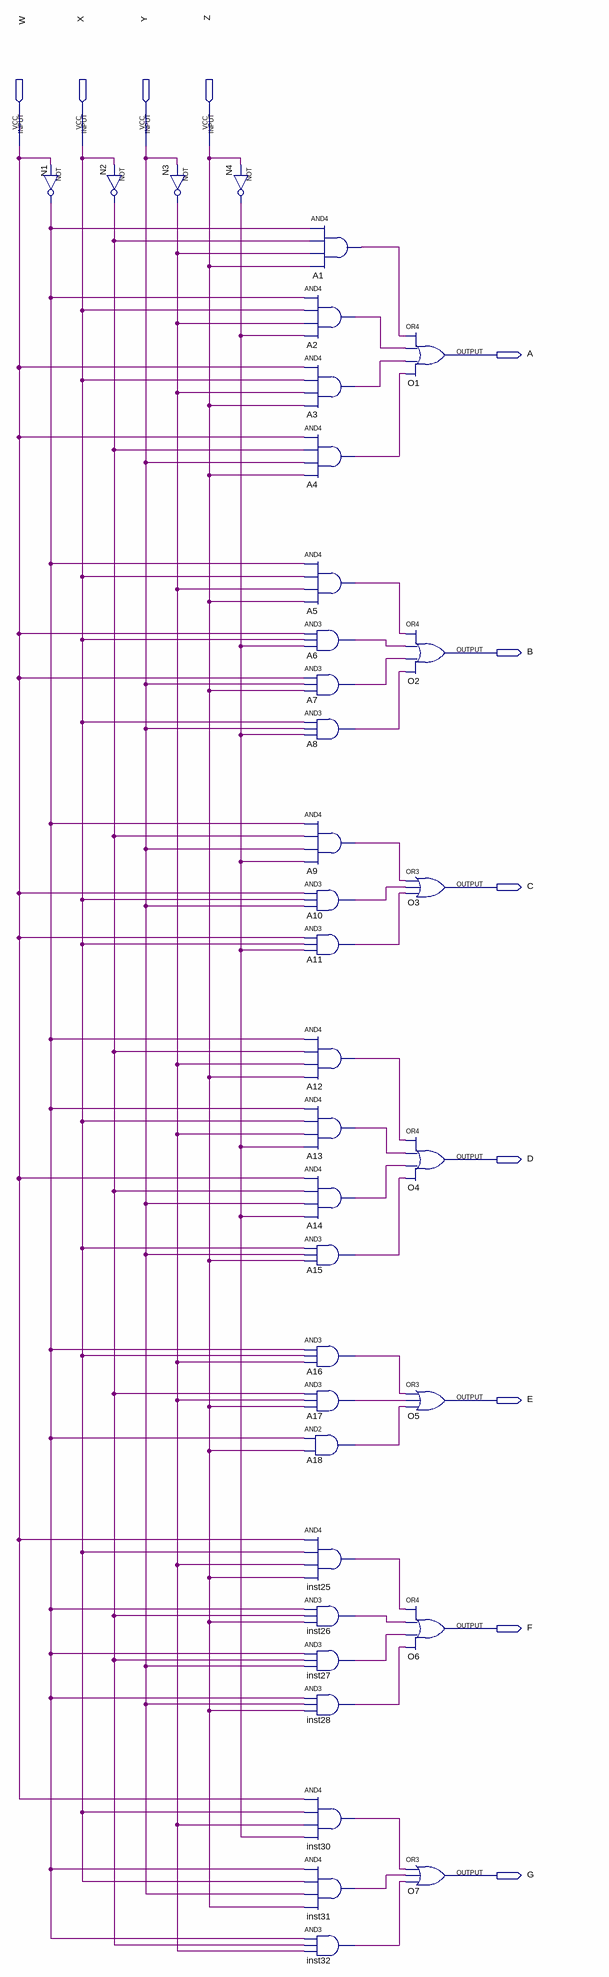
[diagram p0: schematic sheet]
// Quartus schematic lab4.bdf as structural Verilog: 36 symbols, 11 pins
module lab4 (
  input  W,
  input  X,
  input  Y,
  input  Z,
  output A,
  output B,
  output C,
  output D,
  output E,
  output F,
  output G
);

  wire A1_out, A2_out, A3_out, A4_out, A5_out, A6_out, A7_out, A8_out, A9_out, A10_out, A11_out, A12_out,
       A13_out, A14_out, A15_out, A16_out, A17_out, A18_out, inst25_out, inst26_out, inst27_out, inst28_out,
       inst30_out, inst31_out, inst32_out, N1_out, N2_out, N3_out, N4_out;

  not N1 (N1_out, W);
  not N2 (N2_out, X);
  not N3 (N3_out, Y);
  not N4 (N4_out, Z);
  and A1 (A1_out, N1_out, N2_out, N3_out, Z);
  and A2 (A2_out, N1_out, X, N3_out, N4_out);
  and A3 (A3_out, W, X, N3_out, Z);
  and A4 (A4_out, W, N2_out, Y, Z);
  and A5 (A5_out, N1_out, X, N3_out, Z);
  and A6 (A6_out, W, X, N4_out);
  and A7 (A7_out, W, Y, Z);
  and A8 (A8_out, X, Y, N4_out);
  and A9 (A9_out, N1_out, N2_out, Y, N4_out);
  and A10 (A10_out, W, X, Y);
  and A11 (A11_out, W, X, N4_out);
  and A12 (A12_out, N1_out, N2_out, N3_out, Z);
  and A13 (A13_out, N1_out, X, N3_out, N4_out);
  and A14 (A14_out, W, N2_out, Y, N4_out);
  and A15 (A15_out, X, Y, Z);
  and A16 (A16_out, N1_out, X, N3_out);
  and A17 (A17_out, N2_out, N3_out, Z);
  and A18 (A18_out, N1_out, Z);
  and inst25 (inst25_out, W, X, N3_out, Z);
  and inst26 (inst26_out, N1_out, N2_out, Z);
  and inst27 (inst27_out, N1_out, N2_out, Y);
  and inst28 (inst28_out, N1_out, Y, Z);
  and inst30 (inst30_out, W, X, N3_out, N4_out);
  and inst31 (inst31_out, N1_out, X, Y, Z);
  and inst32 (inst32_out, N1_out, N2_out, N3_out);
  or O1 (A, A1_out, A2_out, A3_out, A4_out);
  or O2 (B, A5_out, A6_out, A7_out, A8_out);
  or O3 (C, A9_out, A10_out, A11_out);
  or O4 (D, A12_out, A13_out, A14_out, A15_out);
  or O5 (E, A16_out, A17_out, A18_out);
  or O6 (F, inst25_out, inst26_out, inst27_out, inst28_out);
  or O7 (G, inst30_out, inst31_out, inst32_out);
endmodule
